# Altium schematic sheet PCB_3U_RJ45.schdoc: Title
size 420 x 297 mm; Author: G.K.; CompanyName: WUT; DrawnBy: G.K.; Organization: CERN; Address1: Warsaw Univeristy of Technology; Address2: Nowowiejska 15/19; Revision: -; SheetNumber: -; SheetTotal: -; EDA_Number: ARTIQ; Projet: ADC/DAC MEZZANINE; ModifiedBy: -; CreateDate: XX/XX/XXXX; CheckedDate: -; Title2: Title2; DivGrp: ISE; Designer: G.K.; ModifiedDate: -; ProjectName: ADC/DAC MEZZANINE
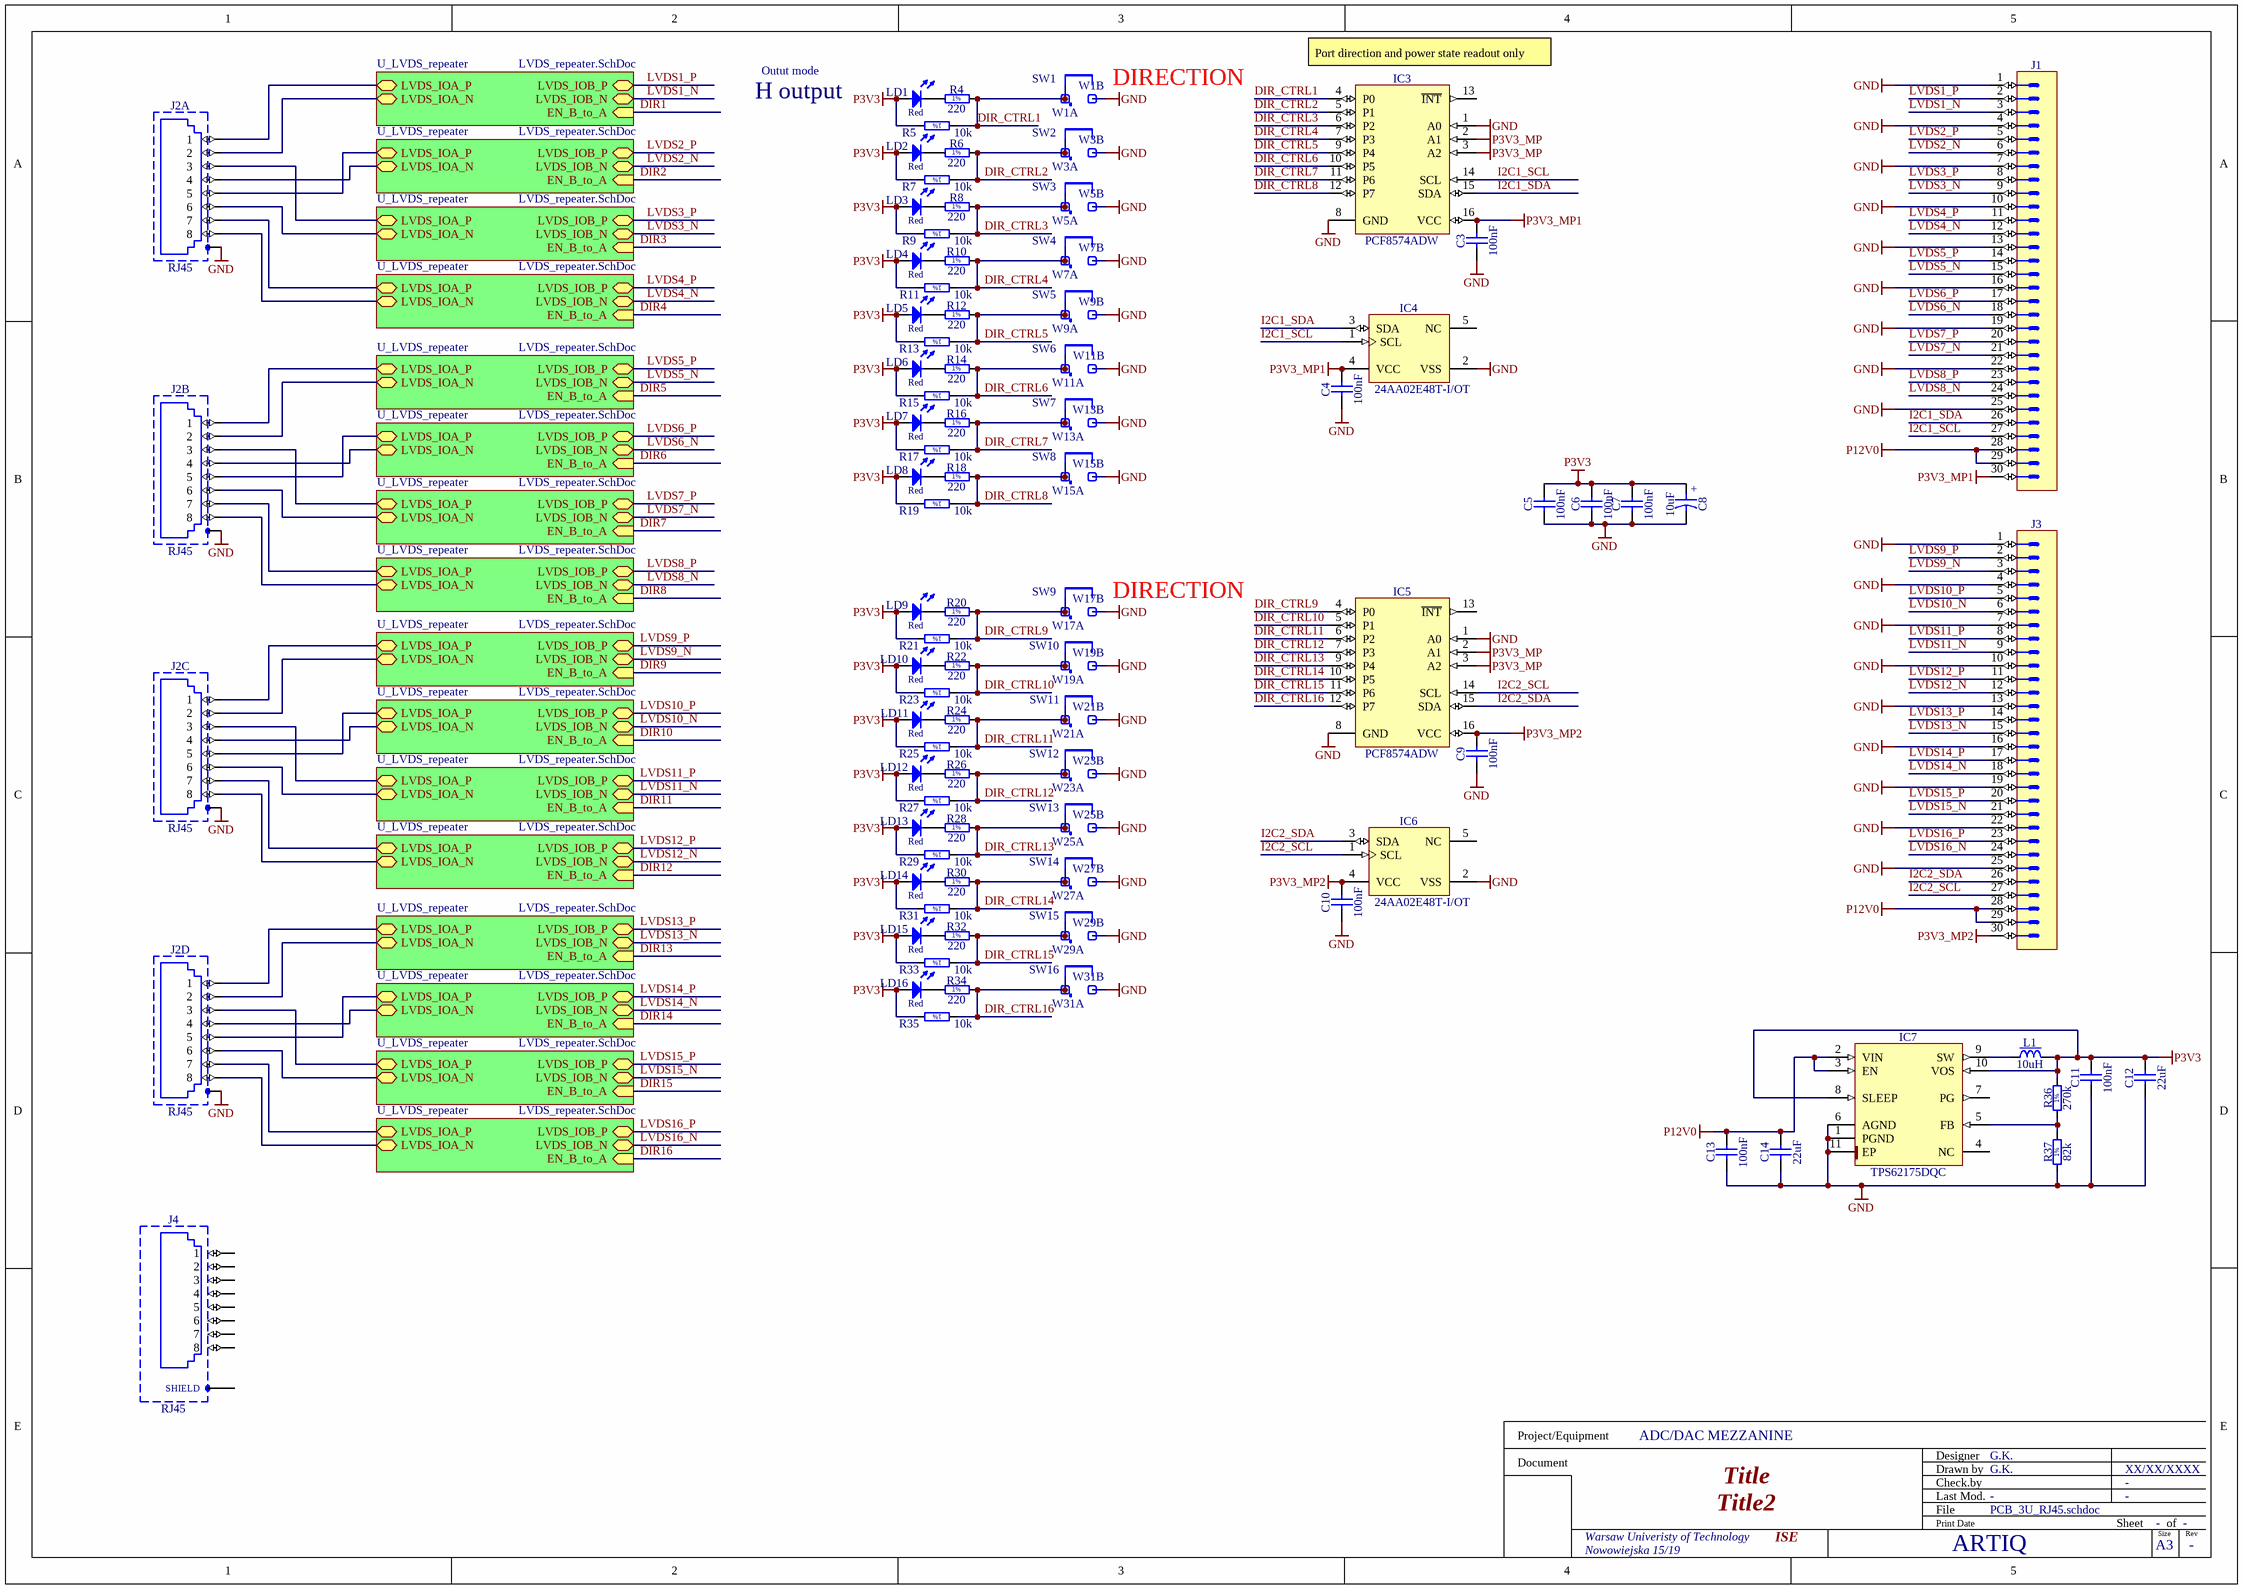
[diagram p0: PCB_3U_RJ45.schdoc]

## Parts
C3  100nF  [CAPC1005X55N]
C4  100nF  [CAPC1005X55N]
C5  100nF  [CAPC1005X55N]
C6  100nF  [CAPC1005X55N]
C7  100nF  [CAPC1005X55N]
C8  10uF  [CAPAE430X540N]
C9  100nF  [CAPC1005X55N]
C10  100nF  [CAPC1005X55N]
C11  100nF  [CAPC1005X55N]
C12  22uF  [CAPC2012X135N]
C13  100nF  [CAPC1005X55N]
C14  22uF  [CAPC2012X135N]
IC3  PCF8574ADW  [SOIC127P1030X265-16N]
IC4  24AA02E48T-I/OT  [SOT95P280X145-5N]
IC5  PCF8574ADW  [SOIC127P1030X265-16N]
IC6  24AA02E48T-I/OT  [SOT95P280X145-5N]
IC7  TPS62175DQC  [SON50P200X300X80-11N-R94X250]
J1  (no value)  [3M_N2530-6002RB]
J2  RJ45  [TYCO_5406203-3]  (parts A,B,C,D of 4)
J3  (no value)  [3M_N2530-6002RB]
J4  RJ45  [FCI_95678-001LF]
L1  10uH  [IND_MURATA-PS_8400]
LD1  Red  [LED_AVAGO_HSMC-C120]  (value not drawn)
LD2  Red  [LED_AVAGO_HSMC-C120]  (value not drawn)
LD3  Red  [LED_AVAGO_HSMC-C120]  (value not drawn)
LD4  Red  [LED_AVAGO_HSMC-C120]  (value not drawn)
LD5  Red  [LED_AVAGO_HSMC-C120]  (value not drawn)
LD6  Red  [LED_AVAGO_HSMC-C120]  (value not drawn)
LD7  Red  [LED_AVAGO_HSMC-C120]  (value not drawn)
LD8  Red  [LED_AVAGO_HSMC-C120]  (value not drawn)
LD9  Red  [LED_AVAGO_HSMC-C120]  (value not drawn)
LD10  Red  [LED_AVAGO_HSMC-C120]  (value not drawn)
LD11  Red  [LED_AVAGO_HSMC-C120]  (value not drawn)
LD12  Red  [LED_AVAGO_HSMC-C120]  (value not drawn)
LD13  Red  [LED_AVAGO_HSMC-C120]  (value not drawn)
LD14  Red  [LED_AVAGO_HSMC-C120]  (value not drawn)
LD15  Red  [LED_AVAGO_HSMC-C120]  (value not drawn)
LD16  Red  [LED_AVAGO_HSMC-C120]  (value not drawn)
R4  220  [RESC1608X55N]
R5  10k  [RESC1005X40N]
R6  220  [RESC1608X55N]
R7  10k  [RESC1005X40N]
R8  220  [RESC1608X55N]
R9  10k  [RESC1005X40N]
R10  220  [RESC1608X55N]
R11  10k  [RESC1005X40N]
R12  220  [RESC1608X55N]
R13  10k  [RESC1005X40N]
R14  220  [RESC1608X55N]
R15  10k  [RESC1005X40N]
R16  220  [RESC1608X55N]
R17  10k  [RESC1005X40N]
R18  220  [RESC1608X55N]
R19  10k  [RESC1005X40N]
R20  220  [RESC1608X55N]
R21  10k  [RESC1005X40N]
R22  220  [RESC1608X55N]
R23  10k  [RESC1005X40N]
R24  220  [RESC1608X55N]
R25  10k  [RESC1005X40N]
R26  220  [RESC1608X55N]
R27  10k  [RESC1005X40N]
R28  220  [RESC1608X55N]
R29  10k  [RESC1005X40N]
R30  220  [RESC1608X55N]
R31  10k  [RESC1005X40N]
R32  220  [RESC1608X55N]
R33  10k  [RESC1005X40N]
R34  220  [RESC1608X55N]
R35  10k  [RESC1005X40N]
R36  270k  [RESC1608X55N]
R37  82k  [RESC1608X55N]
SW1  Jumper Type1  [JUMPER_BLACK_INSULATED_2.54MM]  (value not drawn)
SW2  Jumper Type1  [JUMPER_BLACK_INSULATED_2.54MM]  (value not drawn)
SW3  Jumper Type1  [JUMPER_BLACK_INSULATED_2.54MM]  (value not drawn)
SW4  Jumper Type1  [JUMPER_BLACK_INSULATED_2.54MM]  (value not drawn)
SW5  Jumper Type1  [JUMPER_BLACK_INSULATED_2.54MM]  (value not drawn)
SW6  Jumper Type1  [JUMPER_BLACK_INSULATED_2.54MM]  (value not drawn)
SW7  Jumper Type1  [JUMPER_BLACK_INSULATED_2.54MM]  (value not drawn)
SW8  Jumper Type1  [JUMPER_BLACK_INSULATED_2.54MM]  (value not drawn)
SW9  Jumper Type1  [JUMPER_BLACK_INSULATED_2.54MM]  (value not drawn)
SW10  Jumper Type1  [JUMPER_BLACK_INSULATED_2.54MM]  (value not drawn)
SW11  Jumper Type1  [JUMPER_BLACK_INSULATED_2.54MM]  (value not drawn)
SW12  Jumper Type1  [JUMPER_BLACK_INSULATED_2.54MM]  (value not drawn)
SW13  Jumper Type1  [JUMPER_BLACK_INSULATED_2.54MM]  (value not drawn)
SW14  Jumper Type1  [JUMPER_BLACK_INSULATED_2.54MM]  (value not drawn)
SW15  Jumper Type1  [JUMPER_BLACK_INSULATED_2.54MM]  (value not drawn)
SW16  Jumper Type1  [JUMPER_BLACK_INSULATED_2.54MM]  (value not drawn)
W1  Test Point  [COMATEL_385.0358.1.02.400]  (value not drawn)  (parts A,B of 2)
W3  Test Point  [COMATEL_385.0358.1.02.400]  (value not drawn)  (parts A,B of 2)
W5  Test Point  [COMATEL_385.0358.1.02.400]  (value not drawn)  (parts A,B of 2)
W7  Test Point  [COMATEL_385.0358.1.02.400]  (value not drawn)  (parts A,B of 2)
W9  Test Point  [COMATEL_385.0358.1.02.400]  (value not drawn)  (parts A,B of 2)
W11  Test Point  [COMATEL_385.0358.1.02.400]  (value not drawn)  (parts A,B of 2)
W13  Test Point  [COMATEL_385.0358.1.02.400]  (value not drawn)  (parts A,B of 2)
W15  Test Point  [COMATEL_385.0358.1.02.400]  (value not drawn)  (parts A,B of 2)
W17  Test Point  [COMATEL_385.0358.1.02.400]  (value not drawn)  (parts A,B of 2)
W19  Test Point  [COMATEL_385.0358.1.02.400]  (value not drawn)  (parts A,B of 2)
W21  Test Point  [COMATEL_385.0358.1.02.400]  (value not drawn)  (parts A,B of 2)
W23  Test Point  [COMATEL_385.0358.1.02.400]  (value not drawn)  (parts A,B of 2)
W25  Test Point  [COMATEL_385.0358.1.02.400]  (value not drawn)  (parts A,B of 2)
W27  Test Point  [COMATEL_385.0358.1.02.400]  (value not drawn)  (parts A,B of 2)
W29  Test Point  [COMATEL_385.0358.1.02.400]  (value not drawn)  (parts A,B of 2)
W31  Test Point  [COMATEL_385.0358.1.02.400]  (value not drawn)  (parts A,B of 2)

## Sub-sheets
U_LVDS_repeater = LVDS_repeater.SchDoc: LVDS_IOA_P (bidir), LVDS_IOA_N (bidir), LVDS_IOB_P (bidir), LVDS_IOB_N (bidir), EN_B_to_A (in)
U_LVDS_repeater = LVDS_repeater.SchDoc: LVDS_IOA_P (bidir), LVDS_IOA_N (bidir), LVDS_IOB_P (bidir), LVDS_IOB_N (bidir), EN_B_to_A (in)
U_LVDS_repeater = LVDS_repeater.SchDoc: LVDS_IOA_P (bidir), LVDS_IOA_N (bidir), LVDS_IOB_P (bidir), LVDS_IOB_N (bidir), EN_B_to_A (in)
U_LVDS_repeater = LVDS_repeater.SchDoc: LVDS_IOA_P (bidir), LVDS_IOA_N (bidir), LVDS_IOB_P (bidir), LVDS_IOB_N (bidir), EN_B_to_A (in)
U_LVDS_repeater = LVDS_repeater.SchDoc: LVDS_IOA_P (bidir), LVDS_IOA_N (bidir), LVDS_IOB_P (bidir), LVDS_IOB_N (bidir), EN_B_to_A (in)
U_LVDS_repeater = LVDS_repeater.SchDoc: LVDS_IOA_P (bidir), LVDS_IOA_N (bidir), LVDS_IOB_P (bidir), LVDS_IOB_N (bidir), EN_B_to_A (in)
U_LVDS_repeater = LVDS_repeater.SchDoc: LVDS_IOA_P (bidir), LVDS_IOA_N (bidir), LVDS_IOB_P (bidir), LVDS_IOB_N (bidir), EN_B_to_A (in)
U_LVDS_repeater = LVDS_repeater.SchDoc: LVDS_IOA_P (bidir), LVDS_IOA_N (bidir), LVDS_IOB_P (bidir), LVDS_IOB_N (bidir), EN_B_to_A (in)
U_LVDS_repeater = LVDS_repeater.SchDoc: LVDS_IOA_P (bidir), LVDS_IOA_N (bidir), LVDS_IOB_P (bidir), LVDS_IOB_N (bidir), EN_B_to_A (in)
U_LVDS_repeater = LVDS_repeater.SchDoc: LVDS_IOA_P (bidir), LVDS_IOA_N (bidir), LVDS_IOB_P (bidir), LVDS_IOB_N (bidir), EN_B_to_A (in)
U_LVDS_repeater = LVDS_repeater.SchDoc: LVDS_IOA_P (bidir), LVDS_IOA_N (bidir), LVDS_IOB_P (bidir), LVDS_IOB_N (bidir), EN_B_to_A (in)
U_LVDS_repeater = LVDS_repeater.SchDoc: LVDS_IOA_P (bidir), LVDS_IOA_N (bidir), LVDS_IOB_P (bidir), LVDS_IOB_N (bidir), EN_B_to_A (in)
U_LVDS_repeater = LVDS_repeater.SchDoc: LVDS_IOA_P (bidir), LVDS_IOA_N (bidir), LVDS_IOB_P (bidir), LVDS_IOB_N (bidir), EN_B_to_A (in)
U_LVDS_repeater = LVDS_repeater.SchDoc: LVDS_IOA_P (bidir), LVDS_IOA_N (bidir), LVDS_IOB_P (bidir), LVDS_IOB_N (bidir), EN_B_to_A (in)
U_LVDS_repeater = LVDS_repeater.SchDoc: LVDS_IOA_P (bidir), LVDS_IOA_N (bidir), LVDS_IOB_P (bidir), LVDS_IOB_N (bidir), EN_B_to_A (in)
U_LVDS_repeater = LVDS_repeater.SchDoc: LVDS_IOA_P (bidir), LVDS_IOA_N (bidir), LVDS_IOB_P (bidir), LVDS_IOB_N (bidir), EN_B_to_A (in)

## Nets
GND: C3.1 C4.1 C5.1 C6.1 C7.1 C8.2 C9.1 C10.1 C11.1 C12.1 C13.1 C14.1 IC3.1(A0) IC3.8(GND) IC4.2(VSS) IC5.1(A0) IC5.8(GND) IC6.2(VSS) IC7.1(PGND) IC7.6(AGND) IC7.11(EP) J1.1 J1.4 J1.7 J1.10 J1.13 J1.16 J1.19 J1.22 J1.25 J2.SH J3.1 J3.4 J3.7 J3.10 J3.13 J3.16 J3.19 J3.22 J3.25 R37.1 W1.2 W3.2 W5.2 W7.2 W9.2 W11.2 W13.2 W15.2 W17.2 W19.2 W21.2 W23.2 W25.2 W27.2 W29.2 W31.2
P3V3: C5.2 C6.2 C7.2 C8.1 C11.2 C12.2 IC7.8(SLEEP) IC7.10(VOS) L1.2 LD1.2(A) LD2.2(A) LD3.2(A) LD4.2(A) LD5.2(A) LD6.2(A) LD7.2(A) LD8.2(A) LD9.2(A) LD10.2(A) LD11.2(A) LD12.2(A) LD13.2(A) LD14.2(A) LD15.2(A) LD16.2(A) R5.2 R7.2 R9.2 R11.2 R13.2 R15.2 R17.2 R19.2 R21.2 R23.2 R25.2 R27.2 R29.2 R31.2 R33.2 R35.2 R36.2
P3V3_MP: IC3.2(A1) IC3.3(A2) IC5.2(A1) IC5.3(A2)
P3V3_MP1: C3.2 C4.2 IC3.16(VCC) IC4.4(VCC) J1.30
P3V3_MP2: C9.2 C10.2 IC5.16(VCC) IC6.4(VCC) J3.30
P12V0: C13.2 C14.2 IC7.2(VIN) IC7.3(EN) J1.28 J1.29 J3.28 J3.29
DIR1: sheet U_LVDS_repeater/EN_B_to_A
DIR2: sheet U_LVDS_repeater/EN_B_to_A
DIR3: sheet U_LVDS_repeater/EN_B_to_A
DIR4: sheet U_LVDS_repeater/EN_B_to_A
DIR5: sheet U_LVDS_repeater/EN_B_to_A
DIR6: sheet U_LVDS_repeater/EN_B_to_A
DIR7: sheet U_LVDS_repeater/EN_B_to_A
DIR8: sheet U_LVDS_repeater/EN_B_to_A
DIR9: sheet U_LVDS_repeater/EN_B_to_A
DIR10: sheet U_LVDS_repeater/EN_B_to_A
DIR11: sheet U_LVDS_repeater/EN_B_to_A
DIR12: sheet U_LVDS_repeater/EN_B_to_A
DIR13: sheet U_LVDS_repeater/EN_B_to_A
DIR14: sheet U_LVDS_repeater/EN_B_to_A
DIR15: sheet U_LVDS_repeater/EN_B_to_A
DIR16: sheet U_LVDS_repeater/EN_B_to_A
DIR_CTRL1: IC3.4(P0) R4.2 R5.1 SW1.1 W1.1
DIR_CTRL2: IC3.5(P1) R6.2 R7.1 SW2.1 W3.1
DIR_CTRL3: IC3.6(P2) R8.2 R9.1 SW3.1 W5.1
DIR_CTRL4: IC3.7(P3) R10.2 R11.1 SW4.1 W7.1
DIR_CTRL5: IC3.9(P4) R12.2 R13.1 SW5.1 W9.1
DIR_CTRL6: IC3.10(P5) R14.2 R15.1 SW6.1 W11.1
DIR_CTRL7: IC3.11(P6) R16.2 R17.1 SW7.1 W13.1
DIR_CTRL8: IC3.12(P7) R18.2 R19.1 SW8.1 W15.1
DIR_CTRL9: IC5.4(P0) R20.2 R21.1 SW9.1 W17.1
DIR_CTRL10: IC5.5(P1) R22.2 R23.1 SW10.1 W19.1
DIR_CTRL11: IC5.6(P2) R24.2 R25.1 SW11.1 W21.1
DIR_CTRL12: IC5.7(P3) R26.2 R27.1 SW12.1 W23.1
DIR_CTRL13: IC5.9(P4) R28.2 R29.1 SW13.1 W25.1
DIR_CTRL14: IC5.10(P5) R30.2 R31.1 SW14.1 W27.1
DIR_CTRL15: IC5.11(P6) R32.2 R33.1 SW15.1 W29.1
DIR_CTRL16: IC5.12(P7) R34.2 R35.1 SW16.1 W31.1
I2C1_SCL: IC3.14(SCL) IC4.1(SCL) J1.27
I2C1_SDA: IC3.15(SDA) IC4.3(SDA) J1.26
I2C2_SCL: IC5.14(SCL) IC6.1(SCL) J3.27
I2C2_SDA: IC5.15(SDA) IC6.3(SDA) J3.26
LVDS1_N: J1.3 ; sheet U_LVDS_repeater/LVDS_IOB_N
LVDS1_P: J1.2 ; sheet U_LVDS_repeater/LVDS_IOB_P
LVDS2_N: J1.6 ; sheet U_LVDS_repeater/LVDS_IOB_N
LVDS2_P: J1.5 ; sheet U_LVDS_repeater/LVDS_IOB_P
LVDS3_N: J1.9 ; sheet U_LVDS_repeater/LVDS_IOB_N
LVDS3_P: J1.8 ; sheet U_LVDS_repeater/LVDS_IOB_P
LVDS4_N: J1.12 ; sheet U_LVDS_repeater/LVDS_IOB_N
LVDS4_P: J1.11 ; sheet U_LVDS_repeater/LVDS_IOB_P
LVDS5_N: J1.15 ; sheet U_LVDS_repeater/LVDS_IOB_N
LVDS5_P: J1.14 ; sheet U_LVDS_repeater/LVDS_IOB_P
LVDS6_N: J1.18 ; sheet U_LVDS_repeater/LVDS_IOB_N
LVDS6_P: J1.17 ; sheet U_LVDS_repeater/LVDS_IOB_P
LVDS7_N: J1.21 ; sheet U_LVDS_repeater/LVDS_IOB_N
LVDS7_P: J1.20 ; sheet U_LVDS_repeater/LVDS_IOB_P
LVDS8_N: J1.24 ; sheet U_LVDS_repeater/LVDS_IOB_N
LVDS8_P: J1.23 ; sheet U_LVDS_repeater/LVDS_IOB_P
LVDS9_N: J3.3 ; sheet U_LVDS_repeater/LVDS_IOB_N
LVDS9_P: J3.2 ; sheet U_LVDS_repeater/LVDS_IOB_P
LVDS10_N: J3.6 ; sheet U_LVDS_repeater/LVDS_IOB_N
LVDS10_P: J3.5 ; sheet U_LVDS_repeater/LVDS_IOB_P
LVDS11_N: J3.9 ; sheet U_LVDS_repeater/LVDS_IOB_N
LVDS11_P: J3.8 ; sheet U_LVDS_repeater/LVDS_IOB_P
LVDS12_N: J3.12 ; sheet U_LVDS_repeater/LVDS_IOB_N
LVDS12_P: J3.11 ; sheet U_LVDS_repeater/LVDS_IOB_P
LVDS13_N: J3.15 ; sheet U_LVDS_repeater/LVDS_IOB_N
LVDS13_P: J3.14 ; sheet U_LVDS_repeater/LVDS_IOB_P
LVDS14_N: J3.18 ; sheet U_LVDS_repeater/LVDS_IOB_N
LVDS14_P: J3.17 ; sheet U_LVDS_repeater/LVDS_IOB_P
LVDS15_N: J3.21 ; sheet U_LVDS_repeater/LVDS_IOB_N
LVDS15_P: J3.20 ; sheet U_LVDS_repeater/LVDS_IOB_P
LVDS16_N: J3.24 ; sheet U_LVDS_repeater/LVDS_IOB_N
LVDS16_P: J3.23 ; sheet U_LVDS_repeater/LVDS_IOB_P
NetIC7_5: IC7.5(FB) R36.1 R37.2
NetIC7_9: IC7.9(SW) L1.1
NetJ2_1A: J2.1A(1) ; sheet U_LVDS_repeater/LVDS_IOA_P
NetJ2_1B: J2.1B(1) ; sheet U_LVDS_repeater/LVDS_IOA_P
NetJ2_1C: J2.1C(1) ; sheet U_LVDS_repeater/LVDS_IOA_P
NetJ2_1D: J2.1D(1) ; sheet U_LVDS_repeater/LVDS_IOA_P
NetJ2_2A: J2.2A(2) ; sheet U_LVDS_repeater/LVDS_IOA_N
NetJ2_2B: J2.2B(2) ; sheet U_LVDS_repeater/LVDS_IOA_N
NetJ2_2C: J2.2C(2) ; sheet U_LVDS_repeater/LVDS_IOA_N
NetJ2_2D: J2.2D(2) ; sheet U_LVDS_repeater/LVDS_IOA_N
NetJ2_3A: J2.3A(3) ; sheet U_LVDS_repeater/LVDS_IOA_P
NetJ2_3B: J2.3B(3) ; sheet U_LVDS_repeater/LVDS_IOA_P
NetJ2_3C: J2.3C(3) ; sheet U_LVDS_repeater/LVDS_IOA_P
NetJ2_3D: J2.3D(3) ; sheet U_LVDS_repeater/LVDS_IOA_P
NetJ2_4A: J2.4A(4) ; sheet U_LVDS_repeater/LVDS_IOA_N
NetJ2_4B: J2.4B(4) ; sheet U_LVDS_repeater/LVDS_IOA_N
NetJ2_4C: J2.4C(4) ; sheet U_LVDS_repeater/LVDS_IOA_N
NetJ2_4D: J2.4D(4) ; sheet U_LVDS_repeater/LVDS_IOA_N
NetJ2_5A: J2.5A(5) ; sheet U_LVDS_repeater/LVDS_IOA_P
NetJ2_5B: J2.5B(5) ; sheet U_LVDS_repeater/LVDS_IOA_P
NetJ2_5C: J2.5C(5) ; sheet U_LVDS_repeater/LVDS_IOA_P
NetJ2_5D: J2.5D(5) ; sheet U_LVDS_repeater/LVDS_IOA_P
NetJ2_6A: J2.6A(6) ; sheet U_LVDS_repeater/LVDS_IOA_N
NetJ2_6B: J2.6B(6) ; sheet U_LVDS_repeater/LVDS_IOA_N
NetJ2_6C: J2.6C(6) ; sheet U_LVDS_repeater/LVDS_IOA_N
NetJ2_6D: J2.6D(6) ; sheet U_LVDS_repeater/LVDS_IOA_N
NetJ2_7A: J2.7A(7) ; sheet U_LVDS_repeater/LVDS_IOA_P
NetJ2_7B: J2.7B(7) ; sheet U_LVDS_repeater/LVDS_IOA_P
NetJ2_7C: J2.7C(7) ; sheet U_LVDS_repeater/LVDS_IOA_P
NetJ2_7D: J2.7D(7) ; sheet U_LVDS_repeater/LVDS_IOA_P
NetJ2_8A: J2.8A(8) ; sheet U_LVDS_repeater/LVDS_IOA_N
NetJ2_8B: J2.8B(8) ; sheet U_LVDS_repeater/LVDS_IOA_N
NetJ2_8C: J2.8C(8) ; sheet U_LVDS_repeater/LVDS_IOA_N
NetJ2_8D: J2.8D(8) ; sheet U_LVDS_repeater/LVDS_IOA_N
NetLD1_1: LD1.1(C) R4.1
NetLD2_1: LD2.1(C) R6.1
NetLD3_1: LD3.1(C) R8.1
NetLD4_1: LD4.1(C) R10.1
NetLD5_1: LD5.1(C) R12.1
NetLD6_1: LD6.1(C) R14.1
NetLD7_1: LD7.1(C) R16.1
NetLD8_1: LD8.1(C) R18.1
NetLD9_1: LD9.1(C) R20.1
NetLD10_1: LD10.1(C) R22.1
NetLD11_1: LD11.1(C) R24.1
NetLD12_1: LD12.1(C) R26.1
NetLD13_1: LD13.1(C) R28.1
NetLD14_1: LD14.1(C) R30.1
NetLD15_1: LD15.1(C) R32.1
NetLD16_1: LD16.1(C) R34.1

Not connected (* = marked no-connect by the designer): IC3 13(~{INT}); IC4 5(NC); IC5 13(~{INT}); IC6 5(NC); IC7 4(NC) 7(PG); J4 1 2 3 4 5 6 7 8 SHIELD

## Notes on the sheet
- H output
- Outut mode
- (near W1) DIRECTION
- (near IC3) Port direction and power state readout only
- (near W17) DIRECTION
- Project/Equipment
- Document
- Designer
- Drawn by
- Check.by
- File
- Last Mod.
- Print Date
- Sheet
- Size
- A3
- of
- Rev
- (in symbol CAE430-540_10UF_16V_20%) +
- (in symbol R0402_10K_1%_0.0625W_100PPM) 1%
- (in symbol R0603_82K_1%_0.1W_100PPM) 1%
- (in symbol R0603_220R_1%_0.1W_100PPM) 1%
- (in symbol R0603_270K_1%_0.1W_100PPM) 1%

## Library data of the parts
C3-C7 C9-C11 C13 = CC0402_100NF_16V_10%_X5R: Non-polarised capacitor; Part Description: SMD Multilayer Chip Ceramic Capacitor; Manufacturer: GENERIC; Manufacturer1 Part Number: GRM155R61C104KA88D; Voltage: 16V; TC: X5R; Tolerance: ±10%; Part Number: CC0402_100NF_16V_10%_X5R; Component Kind: Standard; Component Type: Standard; Pin Count: 2; Value: 100nF; Status: None; Manufacturer Part Number: CC0402_100NF_16V_10%_X5R; Case: 0402; Mounted: Yes; Socket: No; SMD: Yes; Sense: No; Manufacturer1 Example: MURATA; Manufacturer1 ComponentHeight: 0.55mm; HelpURL: \\cern.ch\dfs\Applications\Altium\Datasheets\CC0402_X5R_MURATA_GRM.pdf; Author: CERN DEM JLC; CreateDate: 10.12.2013; LatestRevisionDate: 10.12.2013
C8 = CAE430-540_10UF_16V_20%: Polarised capacitor; Part Description: Aluminum Electrolytic SMT Capacitor; Manufacturer: PANASONIC; Manufacturer Part Number: EEEFK1C100AR; Voltage: 16V; Tolerance: ±20%; Part Number: CAE430-540_10UF_16V_20%; Component Kind: Standard; Component Type: Standard; Pin Count: 2; Value: 10uF; Status: Not Recommended; Case: B; Mounted: Yes; Socket: No; SMD: Yes; Sense: No; ComponentHeight: 5.8mm; HelpURL: \\cern.ch\dfs\Applications\Altium\Datasheets\CAE_PANASONIC_FK.pdf; Author: CERN DEM JLC; CreateDate: 03.12.2007; LatestRevisionDate: 05.11.2014
C12 C14 = CC0805_22UF_16V_10%_X5R: Non-polarised capacitor; Part Description: SMD Multilayer Chip Ceramic Capacitor; Manufacturer: GENERIC; Manufacturer1 Part Number: C2012X5R1C226KT; Voltage: 16V; TC: X5R; Tolerance: ±10%; Part Number: CC0805_22UF_16V_10%_X5R; Component Kind: Standard; Component Type: Standard; Pin Count: 2; Value: 22uF; Status: Preferred; Manufacturer Part Number: CC0805_22UF_16V_10%_X5R; Case: 0805; Mounted: Yes; Socket: No; SMD: Yes; Sense: No; Manufacturer1 Example: TDK; Manufacturer1 ComponentHeight: 1.35mm; HelpURL: \\cern.ch\dfs\Applications\Altium\Datasheets\CC0805_X5R_TDK_C.pdf; Author: CERN DEM JLC; CreateDate: 25.10.2012; LatestRevisionDate: 25.10.2012
IC3 IC5 = PCF8574ADW: Remote 8-bit I/O Expander For I2C Bus; Manufacturer: TEXAS INSTRUMENTS; PressFit: No; Bonding: No; Part Number: PCF8574ADW; Component Kind: Standard; Component Type: Standard; Device: PCF8574ADW; PackageDescription: SOIC 16, Pitch 1.27mm - Body 7.5x10.3mm, IPC Medium Density; Part Description: Remote 8-bit I/O Expander For I2C Bus; Manufacturer Part Number: PCF8574ADW; Pin Count: 16; Case: SOIC16W; Mounted: Yes; Socket: No; SMD: Yes; Sense: No; ComponentHeight: 2.65mm; Author: CERN DEM JLC; HelpURL: \\cern.ch\dfs\Applications\Altium\Datasheets\PCF8574ADW.pdf; CreateDate: 01.11.2012; LatestRevisionDate: 01.11.2012
IC4 IC6 = 24AA02E48T-I/OT: 1.7V-5.5V, 2K I2C Serial EEPROM With EUI-48 Node Identity; Manufacturer: MICROCHIP TECHNOLOGY; PressFit: No; Bonding: No; Part Number: 24AA02E48T-I/OT; Component Kind: Standard; Component Type: Standard; Device: 24AA02E48T-I/OT; PackageDescription: SOT, 0.95mm pitch; 5 pin, 1.60mm W X 2.90mm L X 1.45mm H body, IPC Medium Density; Part Description: 1.7V-5.5V, 2K I2C Serial EEPROM With EUI-48 Node Identity; Manufacturer Part Number: 24AA02E48T-I/OT; Pin Count: 5; Case: SOT23-5; Mounted: Yes; Socket: No; SMD: Yes; Sense: No; ComponentHeight: 1.45mm; HelpURL: \\cern.ch\dfs\Applications\Altium\Datasheets\24AA02E48T-I-OT.pdf; Author: CERN DEM MR; CreateDate: 31.03.2016; LatestRevisionDate: 31.03.2016
IC7 = TPS62175DQC: 4.75-28VDC to 1-6VDC, 500mA Step-Down Converter With Sleep Mode; Manufacturer: TEXAS INSTRUMENTS; PressFit: No; Bonding: No; Part Number: TPS62175DQC; Component Kind: Standard; Component Type: Standard; Device: TPS62175DQC; PackageDescription: SON, 10-Leads, Body 2x3mm, Pitch 0.5mm, Thermal Pad 0.94x2.5mm, IPC Medium Density; Part Description: 4.75-28VDC to 1-6VDC, 500mA Step-Down Converter With Sleep Mode; Manufacturer Part Number: TPS62175DQC; Pin Count: 11; Case: SON10; Mounted: Yes; Socket: No; SMD: Yes; Sense: No; ComponentHeight: 0.8mm; HelpURL: \\cern.ch\dfs\Applications\Altium\Datasheets\TPS62175DQC.pdf; Author: CERN DEM JMW; CreateDate: 11.08.2015; LatestRevisionDate: 11.08.2015
J1 J3 = 3M_N2530-6002RB: Connector 30 Male; Part Description: 30 Contacts - Straight .100'' x .100'' Low Profile Four-Wall Header, 2500 Series; Manufacturer: 3M; PressFit: No; Part Number: 3M_N2530-6002RB; Component Kind: Standard; Component Type: Standard; Pin Count: 30; Family: Header 30; Mounted: Yes; Socket: No; SMD: No; Sense: No; Status: None; Manufacturer Part Number: N2530-6002RB; ComponentHeight: 10.03mm; HelpURL: \\cern.ch\dfs\Applications\Altium\Datasheets\3M_N2530-6002RB.pdf; Author: CERN DEM JLC; CreateDate: 11.02.2009; LatestRevisionDate: 11.08.2009
J2 = TYCO_5406203-3: Connector 4 x RJ45 + Shield; Part Description: Modular RJ45 Jack, 4 Port, 8 Positions, Shielded, Reverse Panel Ground Tabs, Category 5; Manufacturer: TYCO ELECTRONICS; PressFit: No; Part Number: TYCO_5406203-3; Component Kind: Standard; Component Type: Standard; Pin Count: 33; Family: RJ45; Mounted: Yes; Socket: No; SMD: No; Sense: No; Status: None; Manufacturer Part Number: 5406203-3; ComponentHeight: 13.64mm; HelpURL: \\cern.ch\dfs\Applications\Altium\Datasheets\TYCO_5406203-3.pdf; Author: CERN DEM JLC; CreateDate: 30.10.2008; LatestRevisionDate: 30.10.2008
J4 = FCI_95678-001LF: 1 Port, 8 Positions Shielded Snap PEG, CAT5 RJ45 Horizontal Modular Jack; Manufacturer: FCI; PressFit: No; Part Number: FCI_95678-001LF; Component Kind: Standard; Component Type: Standard; Pin Count: 10; Family: RJ45; Mounted: Yes; Socket: No; SMD: No; Sense: No; Status: None; Part Description: 1 Port, 8 Positions Shielded Snap PEG, CAT5 RJ45 Horizontal Modular Jack; Manufacturer Part Number: 95678-001LF; ComponentHeight: 13.99mm; HelpURL: \\cern.ch\dfs\Applications\Altium\Datasheets\FCI_95678-001LF.pdf; Author: CERN DEM BC; CreateDate: 28.07.2015; LatestRevisionDate: 28.07.2015
L1 = IND_10UH_10%_MURATA-PS_8400: Inductor With Core; Part Description: Miniature Surface Mount Power Inductor (8400 Serie); Manufacturer: MURATA POWER SOLUTIONS; Manufacturer Part Number: 84103C; Power: 950mA; Resistance: 0.24R; Tolerance: ±10%; Part Number: IND_10UH_10%_MURATA-PS_8400; Component Kind: Standard; Component Type: Standard; Pin Count: 2; Value: 10uH; Status: None; Mounted: Yes; Socket: No; SMD: Yes; Sense: No; ComponentHeight: 2.9mm; HelpURL: \\cern.ch\dfs\Applications\Altium\Datasheets\IND_MURATA-PS_8400.pdf; Author: CERN DEM JLC; CreateDate: 02.07.2012; LatestRevisionDate: 02.07.2012
LD1-LD16 = LED_AVAGO_HSMC-C120: LED Red 1C 2A; Part Description: High Performance Right Angle Chip Red LED; Manufacturer: AVAGO TECHNOLOGIES; PressFit: No; Bonding: No; Part Number: LED_AVAGO_HSMC-C120; Component Kind: Standard; Component Type: Standard; Color: Red; PackageDescription: Red Chip LED, 2-Leads, Body 1.7x1.1mm, Side Emitting Package; Manufacturer Part Number: HSMC-C120; Pin Count: 2; Mounted: Yes; Socket: No; SMD: Yes; Sense: No; ComponentHeight: 0.7mm; HelpURL: \\cern.ch\dfs\Applications\Altium\Datasheets\LED_AVAGO_HSMC-C120.pdf; ComponentLink1URL: \\cern.ch\dfs\Applications\Altium\Datasheets\LED_AVAGO_HSMC-C120_DESIGN-GUIDE.pdf; ComponentLink1Description: Design Guide; Author: CERN DEM JMW; CreateDate: 22.07.2009; LatestRevisionDate: 20.06.2012
R4 R6 R8 R10 R12 R14 R16 R18 R20 R22 R24 R26 R28 R30 R32 R34 = R0603_220R_1%_0.1W_100PPM: Resistor - 1%; Part Description: General Purpose Thick Film Chip Resistor; Manufacturer: GENERIC; Manufacturer1 Part Number: NRC06F2200TRF; Power: 0.1W; TC: ±100ppm/°C; Part Number: R0603_220R_1%_0.1W_100PPM; Component Kind: Standard; Component Type: Standard; Pin Count: 2; Value: 220; Status: Preferred; Tolerance: ±1%; Manufacturer Part Number: R0603_220R_1%_0.1W_100PPM; Case: 0603; Mounted: Yes; Sense: No; Socket: No; SMD: Yes; Manufacturer1 Example: NIC COMPONENT; Manufacturer1 ComponentHeight: 0.55mm; HelpURL: \\cern.ch\dfs\Applications\Altium\Datasheets\R0603_NIC_NRC.pdf; Author: CERN DEM JLC; CreateDate: 03.12.2007; LatestRevisionDate: 13.03.2008
R5 R7 R9 R11 R13 R15 R17 R19 R21 R23 R25 R27 R29 R31 R33 R35 = R0402_10K_1%_0.0625W_100PPM: Resistor - 1%; Part Description: General Purpose Thick Film Chip Resistor; Manufacturer: GENERIC; Manufacturer1 Part Number: 232270671003L; TC: ±100ppm/°C; Part Number: R0402_10K_1%_0.0625W_100PPM; Component Kind: Standard; Component Type: Standard; Pin Count: 2; Value: 10k; Status: Not recommended; Power: 0.0625W; Tolerance: ±1%; Manufacturer Part Number: R0402_10K_1%_0.0625W_100PPM; Case: 0402; Mounted: Yes; Sense: No; Socket: No; SMD: Yes; Manufacturer1 Example: YAGEO PHYCOMP; Manufacturer1 ComponentHeight: 0.4mm; HelpURL: \\cern.ch\dfs\Applications\Altium\Datasheets\R0402_Phycomp_RC0402.pdf; Author: CERN DEM JLC; CreateDate: 03.12.2007; LatestRevisionDate: 17.10.2012
R36 = R0603_270K_1%_0.1W_100PPM: Resistor - 1%; Part Description: General Purpose Thick Film Chip Resistor; Manufacturer: GENERIC; Manufacturer1 Part Number: NRC06F2703TRF; Power: 0.1W; TC: ±100ppm/°C; Part Number: R0603_270K_1%_0.1W_100PPM; Component Kind: Standard; Component Type: Standard; Pin Count: 2; Value: 270k; Status: Preferred; Tolerance: ±1%; Manufacturer Part Number: R0603_270K_1%_0.1W_100PPM; Case: 0603; Mounted: Yes; Sense: No; Socket: No; SMD: Yes; Manufacturer1 Example: NIC COMPONENT; Manufacturer1 ComponentHeight: 0.55mm; HelpURL: \\cern.ch\dfs\Applications\Altium\Datasheets\R0603_NIC_NRC.pdf; Author: CERN DEM JLC; CreateDate: 03.12.2007; LatestRevisionDate: 13.03.2008
R37 = R0603_82K_1%_0.1W_100PPM: Resistor - 1%; Part Description: General Purpose Thick Film Chip Resistor; Manufacturer: GENERIC; Manufacturer1 Part Number: NRC06F8202TRF; Power: 0.1W; TC: ±100ppm/°C; Part Number: R0603_82K_1%_0.1W_100PPM; Component Kind: Standard; Component Type: Standard; Pin Count: 2; Value: 82k; Status: Preferred; Tolerance: ±1%; Manufacturer Part Number: R0603_82K_1%_0.1W_100PPM; Case: 0603; Mounted: Yes; Sense: No; Socket: No; SMD: Yes; Manufacturer1 Example: NIC COMPONENT; Manufacturer1 ComponentHeight: 0.55mm; HelpURL: \\cern.ch\dfs\Applications\Altium\Datasheets\R0603_NIC_NRC.pdf; Author: CERN DEM JLC; CreateDate: 03.12.2007; LatestRevisionDate: 13.03.2008
SW1-SW16 = COMATEL_313.1730.0.00.40.0: Jumper 1 Pin; Part Description: Closed Insulated Black Jumper Pitch 2.54mm; Manufacturer: KONTEK COMATEL; PressFit: No; SCEM: 09.55.10.960.9; Part Number: COMATEL_313.1730.0.00.40.0; Component Kind: Standard; Component Type: Standard; Pin Count: 1; Family: Jumper; Mounted: Yes; Socket: No; SMD: No; Sense: No; Status: Obsolete; Manufacturer Part Number: 313.1730.0.00.40.0; ComponentHeight: 6.5mm; HelpURL: \\cern.ch\dfs\Applications\Altium\Datasheets\COMATEL_313.1730.0.00.40.0.pdf; Author: CERN DEM JLC; CreateDate: 09.04.2008; LatestRevisionDate: 27.08.2013
W1 W3 W5 W7 W9 W11 W13 W15 W17 W19 W21 W23 W25 W27 W29 W31 = COMATEL_385.0358.1.02.400: 2 Mini Wire-Wrap Contact Strip Header; Part Description: 2 Contacts Straight Strip Header Pitch 2.54mm L=6.3mm ''Mini-Wire-Wrap''; Manufacturer: KONTEK COMATEL; PressFit: No; Part Number: COMATEL_385.0358.1.02.400; Component Kind: Standard; Component Type: Standard; Pin Count: 2; Family: Test Point; Mounted: Yes; Socket: No; SMD: No; Sense: No; Status: Not recommended; Manufacturer Part Number: 385.0358.1.02.400; ComponentHeight: 8mm; HelpURL: \\cern.ch\dfs\Applications\Altium\Datasheets\COMATEL_385.0358.1.02.400.pdf; Author: CERN DEM JLC; CreateDate: 30.06.2010; LatestRevisionDate: 10.10.2012